# EAGLE design SSM4 (EAGLE 6.2)
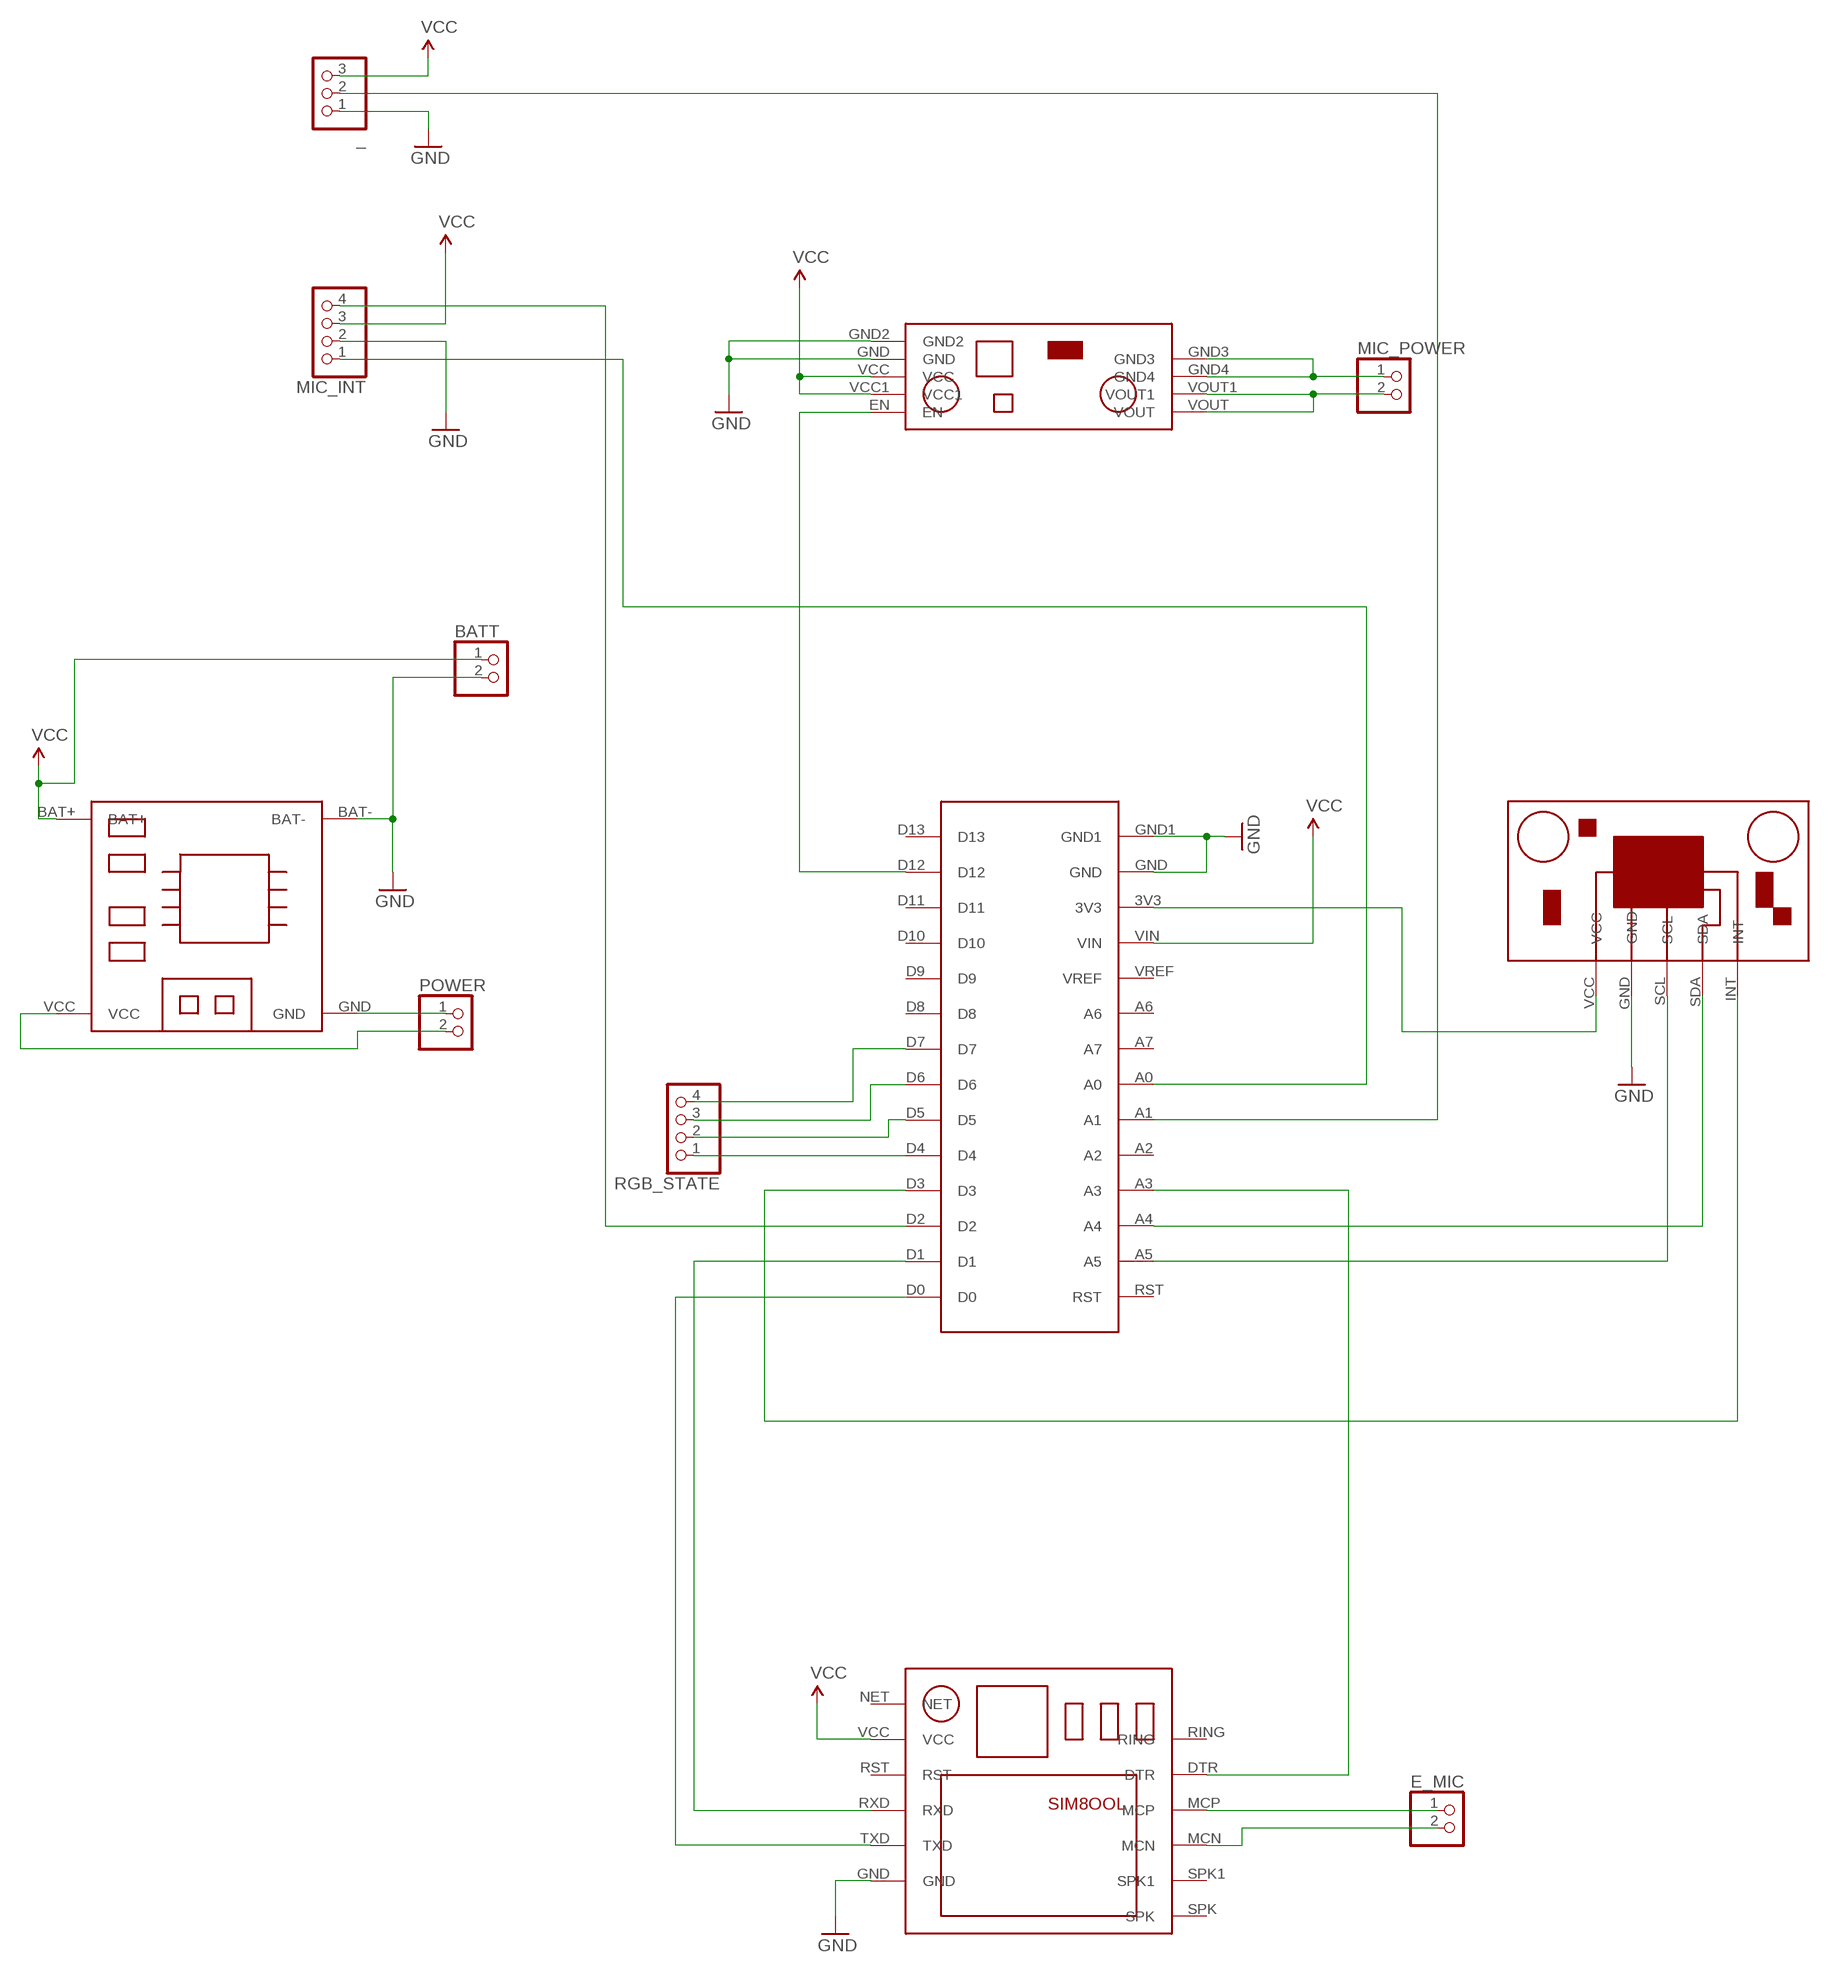
[diagram p0: schematic, sheet 1]

## Parts
_  PINHD-1X3  [1X03]
BATT  PINHD-1X2  [1X02]
E_MIC  PINHD-1X2  [1X02]
MIC_INT  PINHD-1X4  [1X04]
MIC_POWER  PINHD-1X2  [1X02]
POWER  PINHD-1X2  [1X02]
RGB_STATE  PINHD-1X4  [1X04]
U$1  ACELEROMETER  [ACELEROMETER]
U$2  POLOLU_STEP_UP_DOWN  [POLOLU_STEP_UP_DOWN]
U$3  CHARGER  [CHARGER]
U$4  SIM8OOL  [SIM8OOL]
U$5  ULTRA_MINI  [ULTRA_MINI]

## Nets
GND: _.1 BATT.2 MIC_INT.2 U$1.GND U$2.GND U$2.GND2 U$3.BAT- U$4.GND U$5.GND U$5.GND1
N$1: U$2.EN U$5.D12
N$2: U$4.TXD U$5.D0
N$3: U$4.RXD U$5.D1
N$4: U$1.VCC U$5.3V3
N$5: U$4.DTR U$5.A3
N$6: U$1.INT U$5.D3
N$7: U$1.SCL U$5.A5
N$8: U$1.SDA U$5.A4
N$9: E_MIC.1 U$4.MCP
N$10: E_MIC.2 U$4.MCN
N$11: POWER.1 U$3.GND
N$12: POWER.2 U$3.VCC
N$13: MIC_POWER.1 U$2.GND3 U$2.GND4
N$14: MIC_POWER.2 U$2.VOUT U$2.VOUT1
N$15: MIC_INT.1 U$5.A0
N$16: MIC_INT.4 U$5.D2
N$17: _.2 U$5.A1
N$18: RGB_STATE.1 U$5.D4
N$19: RGB_STATE.2 U$5.D5
N$20: RGB_STATE.3 U$5.D6
N$21: RGB_STATE.4 U$5.D7
VCC: _.3 BATT.1 MIC_INT.3 U$2.VCC U$2.VCC1 U$3.BAT+ U$4.VCC U$5.VIN
Unconnected: U$4.NET U$4.RING U$4.RST U$4.SPK U$4.SPK1 U$5.A2 U$5.A6 U$5.A7 U$5.D8 U$5.D9 U$5.D10 U$5.D11 U$5.D13 U$5.RST U$5.VREF

## Library data of the parts
_ = pinhead:PINHD-1X3: PIN HEADER
BATT E_MIC MIC_POWER POWER = pinhead:PINHD-1X2: PIN HEADER
MIC_INT RGB_STATE = pinhead:PINHD-1X4: PIN HEADER
U$1 = ACELEROMETER:ACELEROMETER
U$2 = BOOSTER:POLOLU_STEP_UP_DOWN
U$3 = CHARGER:CHARGER
U$4 = SIM8OOL:SIM8OOL
U$5 = ULTRA_MINI:ULTRA_MINI: ARDUINO_ULTRA_MINI. Rocketscream. By Dennis Revolorio on Flatbox

## Board
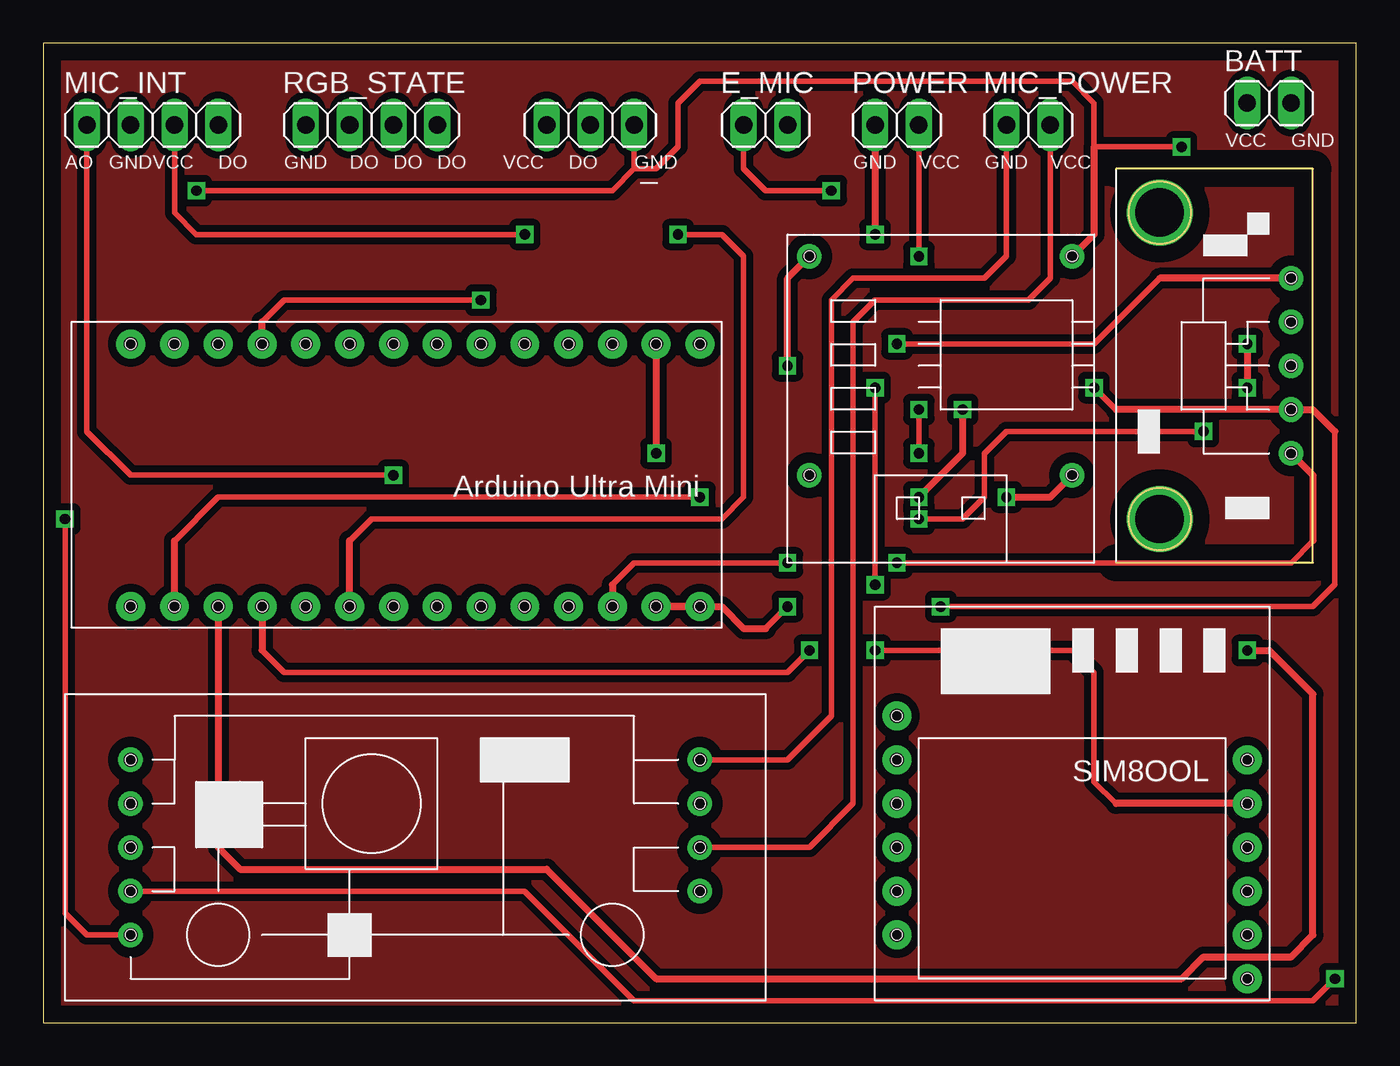
[diagram p1: board, top side]
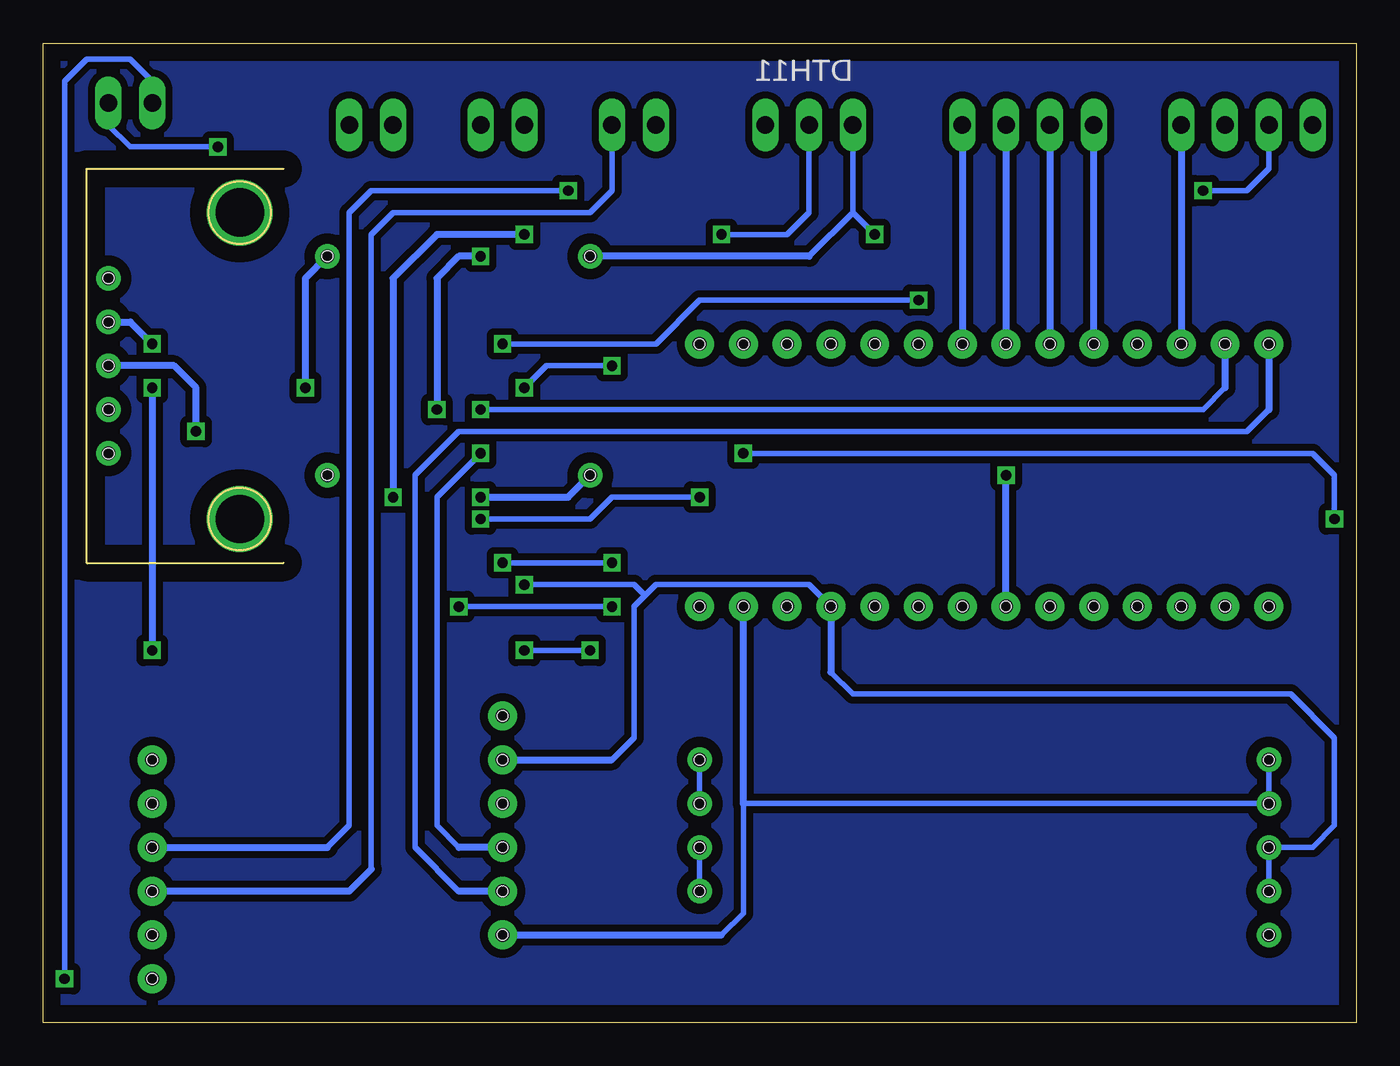
[diagram p2: board, bottom side, seen from below]

Size 76.18 x 56.82 mm. Coordinates in mm from the lower left corner, seen from the top.
Outline: 0,0 76.18,0 76.18,56.82 0,56.82 0,0
Copper layers (1*16): Top 0.035mm / dielectric 1.5mm / Bottom 0.035mm
Design rules: minimum track width 10mil, minimum drill 24mil, track to track 8mil, track to pad 8mil, pad to pad 8mil, via to via 8mil, smd to smd 8mil, copper to edge 40mil, drill to drill 8mil, minimum pad ring 10mil, minimum via ring 8mil, stop-mask expansion 4mil, vias tented up to drill 0mil, thermal gap 10mil

### Footprints (pad centres in the part's own frame; a part is rotated, then mirrored left to right if it is on the bottom)
1X03 = drill 1.016 long: 1 -2.54,0; 2 0,0; 3 2.54,0
1X02 = drill 1.016 long: 1 -1.27,0; 2 1.27,0
1X04 = drill 1.016 long: 1 -3.81,0; 2 -1.27,0; 3 1.27,0; 4 3.81,0
ACELEROMETER = drill 0.8 pad 1.422: GND -20.32,2.54; INT -12.7,2.54; SCL -17.78,2.54; SDA -15.24,2.54; VCC -22.86,2.54 | drill 2.8 pad 3.81: P$1 -26.67,10.16; P$2 -8.89,10.16 | hole 0.6: -22.86,2.54; -20.32,2.54; -17.78,2.54; -15.24,2.54; -12.7,2.54
POLOLU_STEP_UP_DOWN = drill 0.8 pad 1.422: EN -17.78,6.35; GND -10.16,6.35; GND2 -7.62,6.35; GND3 -7.62,-26.67; GND4 -10.16,-26.67; VCC -12.7,6.35; VCC1 -15.24,6.35; VOUT -12.7,-26.67; VOUT1 -15.24,-26.67 | hole 0.6: -17.78,6.35; -15.24,6.35; -12.7,6.35; -10.16,6.35; -7.62,6.35; -7.62,-26.67; -10.16,-26.67; -12.7,-26.67; -15.24,-26.67
CHARGER = drill 0.8 pad 1.422: BAT+ -19.05,6.35; BAT- -3.81,6.35; GND -3.81,-6.35; VCC -19.05,-6.35 | hole 0.6: -19.05,6.35; -19.05,-6.35; -3.81,-6.35; -3.81,6.35
SIM8OOL = drill 0.8 pad 1.676: DTR 2.54,1.27; GND -17.78,-6.35; MCN 2.54,-3.81; MCP 2.54,-1.27; NET -17.78,6.35; RING 2.54,3.81; RST -17.78,1.27; RXD -17.78,-1.27; SPK 2.54,-8.89; SPK1 2.54,-6.35; TXD -17.78,-3.81; VCC -17.78,3.81 | hole 0.6: -17.78,6.35; -17.78,3.81; -17.78,1.27; -17.78,-1.27; -17.78,-3.81; -17.78,-6.35; 2.54,3.81; 2.54,1.27; 2.54,-1.27; 2.54,-3.81; 2.54,-6.35; 2.54,-8.89
ULTRA_MINI = drill 0.8 pad 1.676: 3V3 6.35,16.51; A0 19.05,16.51; A1 21.59,16.51; A2 24.13,16.51; A3 26.67,16.51; A4 29.21,16.51; A5 31.75,16.51; A6 13.97,16.51; A7 16.51,16.51; D0 34.29,1.27; D1 31.75,1.27; D2 29.21,1.27; D3 26.67,1.27; D4 24.13,1.27; D5 21.59,1.27; D6 19.05,1.27; D7 16.51,1.27; D8 13.97,1.27; D9 11.43,1.27; D10 8.89,1.27; D11 6.35,1.27; D12 3.81,1.27; D13 1.27,1.27; GND 3.81,16.51; GND1 1.27,16.51; RST 34.29,16.51; VIN 8.89,16.51; VREF 11.43,16.51 | hole 0.6: 1.27,16.51; 3.81,16.51; 6.35,16.51; 8.89,16.51; 11.43,16.51; 13.97,16.51; 16.51,16.51; 19.05,16.51; 21.59,16.51; 24.13,16.51; 26.67,16.51; 29.21,16.51; 31.75,16.51; 34.29,16.51; 1.27,1.27; 3.81,1.27; 6.35,1.27; 8.89,1.27; 13.97,1.27; 11.43,1.27; 16.51,1.27; 19.05,1.27; 21.59,1.27; 34.29,1.27; 31.75,1.27; 29.21,1.27; 26.67,1.27; 24.13,1.27

### Placement (x,y rotation side)
_  31.75,52.07 180 top
BATT  71.12,53.34 0 top
E_MIC  41.91,52.07 0 top
MIC_INT  6.35,52.07 0 top
MIC_POWER  57.15,52.07 0 top
POWER  49.53,52.07 0 top
RGB_STATE  19.05,52.07 0 top
U$1  74.93,55.88 90 top
U$2  11.43,22.86 90 top
U$3  63.5,38.1 0 top
U$4  67.31,11.43 0 top
U$5  39.37,40.64 180 top

### Tracks (layer width: path | path; a pad name or v marks a point on that pad's centre or on a via)
GND  (via drill 0.6)
  Top 0.305: v8.89,48.26 33.02,48.26 34.29,49.53 | 34.29,49.53 _.1 | 62.23,35.56 v60.96,36.83 | 34.29,49.53 35.56,49.53 36.83,50.8 36.83,53.34 38.1,54.61 59.69,54.61 60.96,53.34 60.96,50.8 v66.04,50.8 | 41.91,22.86 v43.18,24.13 | v52.07,24.13 73.66,24.13 74.93,25.4 74.93,34.29
  Top 0.406: 60.96,50.8 60.96,45.72 U$3.BAT- | 74.93,34.29 73.66,35.56 U$1.GND 62.23,35.56 | U$5.GND1 U$5.GND 39.37,24.13 40.64,22.86 41.91,22.86
  Bottom 0.305: MIC_INT.2 5.08,49.53 6.35,48.26 v8.89,48.26 | 36.83,5.08 35.56,6.35 35.56,12.7 U$2.GND U$2.GND2 | v43.18,24.13 v52.07,24.13 | BATT.2 72.39,52.07 71.12,50.8 v66.04,50.8
  Bottom 0.406: v60.96,36.83 60.96,43.18 U$3.BAT- | 35.56,12.7 U$5.GND | U$4.GND 36.83,5.08
N$1  (via drill 0.6)
  Top 0.305: U$2.EN 2.54,5.08 1.27,6.35 v1.27,29.21
  Top 0.406: U$5.D12 v35.56,33.02
  Bottom 0.305: v1.27,29.21 1.27,31.75 2.54,33.02 v35.56,33.02
N$2
  Bottom 0.305: 5.08,35.56 6.35,34.29 52.07,34.29 54.61,31.75 54.61,10.16 52.07,7.62
  Bottom 0.406: U$5.D0 5.08,35.56 | U$4.TXD 52.07,7.62
N$3  (via drill 0.6)
  Top 0.305: v50.8,33.02 v50.8,35.56
  Bottom 0.305: 52.07,10.16 53.34,11.43 53.34,30.48 v50.8,33.02 | v50.8,35.56 8.89,35.56 7.62,36.83
  Bottom 0.406: U$5.D1 7.62,36.83 | U$4.RXD 52.07,10.16
N$4  (via drill 0.6)
  Top 0.305: 33.02,25.4 34.29,26.67 v43.18,26.67 | v49.53,26.67 72.39,26.67 73.66,27.94
  Top 0.406: U$1.VCC 73.66,31.75 73.66,27.94 | 33.02,25.4 U$5.3V3
  Bottom 0.305: v43.18,26.67 v49.53,26.67
N$5  (via drill 0.6)
  Top 0.305: 62.23,12.7 60.96,13.97 60.96,20.32 59.69,21.59 v48.26,21.59 | v44.45,21.59 43.18,20.32 13.97,20.32 12.7,21.59
  Top 0.406: U$5.A3 12.7,21.59 | U$4.DTR 62.23,12.7
  Bottom 0.305: v48.26,21.59 v44.45,21.59
N$6  (via drill 0.6)
  Top 0.305: 64.77,43.18 60.96,39.37 v49.53,39.37 | v25.4,41.91 13.97,41.91 12.7,40.64
  Top 0.406: U$1.INT 64.77,43.18 | U$5.D3 12.7,40.64
  Bottom 0.305: v49.53,39.37 40.64,39.37 38.1,41.91 v25.4,41.91
N$7  (via drill 0.6)
  Top 0.305: 7.62,27.94 10.16,30.48 v38.1,30.48 | v50.8,29.21 53.34,29.21 54.61,30.48 54.61,33.02 55.88,34.29 v67.31,34.29
  Top 0.406: U$5.A5 7.62,27.94
  Bottom 0.305: v38.1,30.48 43.18,30.48 44.45,29.21 v50.8,29.21
  Bottom 0.406: v67.31,34.29 67.31,36.83 68.58,38.1 U$1.SCL
N$8  (via drill 0.6)
  Top 0.406: v69.85,39.37 v69.85,36.83 | v69.85,21.59 71.12,21.59 73.66,19.05 73.66,5.08 72.39,3.81 67.31,3.81 66.04,2.54 35.56,2.54 29.21,8.89 11.43,8.89 10.16,10.16 U$5.A4
  Bottom 0.406: U$1.SDA 71.12,40.64 v69.85,39.37 | v69.85,36.83 v69.85,21.59
N$9  (via drill 0.6)
  Top 0.305: v45.72,48.26 41.91,48.26 40.64,49.53 E_MIC.1
  Bottom 0.305: 59.69,10.16 58.42,11.43 58.42,46.99 57.15,48.26 v45.72,48.26
  Bottom 0.406: U$4.MCP 59.69,10.16
N$10
  Bottom 0.305: E_MIC.2 43.18,48.26 44.45,46.99 55.88,46.99 57.15,45.72 57.15,8.89
  Bottom 0.406: 57.15,8.89 58.42,7.62 U$4.MCN
N$11  (via drill 0.6)
  Top 0.406: POWER.1 v48.26,45.72 | v55.88,30.48 58.42,30.48 U$3.GND
  Bottom 0.406: v48.26,45.72 53.34,45.72 55.88,43.18 v55.88,30.48
N$12  (via drill 0.6)
  Top 0.305: POWER.2 v50.8,44.45
  Top 0.406: v53.34,35.56 53.34,33.02 v50.8,30.48
  Bottom 0.406: v50.8,44.45 52.07,44.45 53.34,43.18 v53.34,35.56 | v50.8,30.48 45.72,30.48 U$3.VCC
N$13
  Top 0.305: U$2.GND3 43.18,15.24 45.72,17.78 45.72,41.91 46.99,43.18 54.61,43.18 55.88,44.45 MIC_POWER.1
  Bottom 0.305: U$2.GND4 U$2.GND3
N$14
  Top 0.305: MIC_POWER.2 58.42,43.18 57.15,41.91 48.26,41.91 46.99,40.64 46.99,12.7 44.45,10.16 U$2.VOUT
  Bottom 0.305: U$2.VOUT1 U$2.VOUT
N$15  (via drill 0.6)
  Top 0.305: MIC_INT.1 2.54,34.29 5.08,31.75 v20.32,31.75
  Bottom 0.406: U$5.A0 v20.32,31.75
N$16
  Bottom 0.406: MIC_INT.4 U$5.D2
N$17  (via drill 0.6)
  Top 0.305: v36.83,45.72 39.37,45.72 40.64,44.45 40.64,30.48 39.37,29.21 19.05,29.21 17.78,27.94
  Top 0.406: U$5.A1 17.78,27.94
  Bottom 0.305: _.2 31.75,46.99 33.02,45.72 v36.83,45.72
N$18
  Bottom 0.406: U$5.D4 RGB_STATE.1
N$19
  Bottom 0.406: RGB_STATE.2 U$5.D5
N$20
  Bottom 0.406: RGB_STATE.3 U$5.D6
N$21
  Bottom 0.406: RGB_STATE.4 U$5.D7
N$22
  pour Top (isolate 0.406): 0,57.15 76.2,57.15 76.2,0 0,0
N$23
  pour Bottom (isolate 0.406): 0,57.15 76.2,57.15 76.2,0 0,0 0,55.88
VCC  (via drill 0.6)
  Top 0.305: MIC_INT.3 7.62,46.99 8.89,45.72 v27.94,45.72 | v48.26,36.83 v48.26,25.4 | U$2.VCC1 27.94,7.62 34.29,1.27 73.66,1.27 v74.93,2.54
  Top 0.406: v43.18,38.1 43.18,43.18 U$3.BAT+
  Bottom 0.305: 31.75,44.45 29.21,46.99 | 29.21,46.99 _.3 | U$2.VCC1 U$2.VCC 2.54,10.16 1.27,11.43 1.27,16.51 3.81,19.05 29.21,19.05 30.48,20.32 | v27.94,45.72 29.21,46.99 | 43.18,15.24 41.91,16.51 41.91,24.13 41.27,24.77 | 41.27,24.77 40.64,25.4 31.75,25.4 U$5.VIN | v43.18,38.1 46.99,38.1 v48.26,36.83 | v48.26,25.4 41.91,25.4 41.27,24.77 | v74.93,2.54 74.93,54.61 73.66,55.88 71.12,55.88 69.85,54.61 BATT.1
  Bottom 0.406: 31.75,44.45 U$3.BAT+ | U$5.VIN 30.48,20.32 | U$4.VCC 43.18,15.24

### Text on the board
tPlace: VCC | GND | AO | GND | VCC | DO | GND | DO | DO | DO | VCC | DO | GND | GND | VCC | GND | VCC
bPlace: DTH11